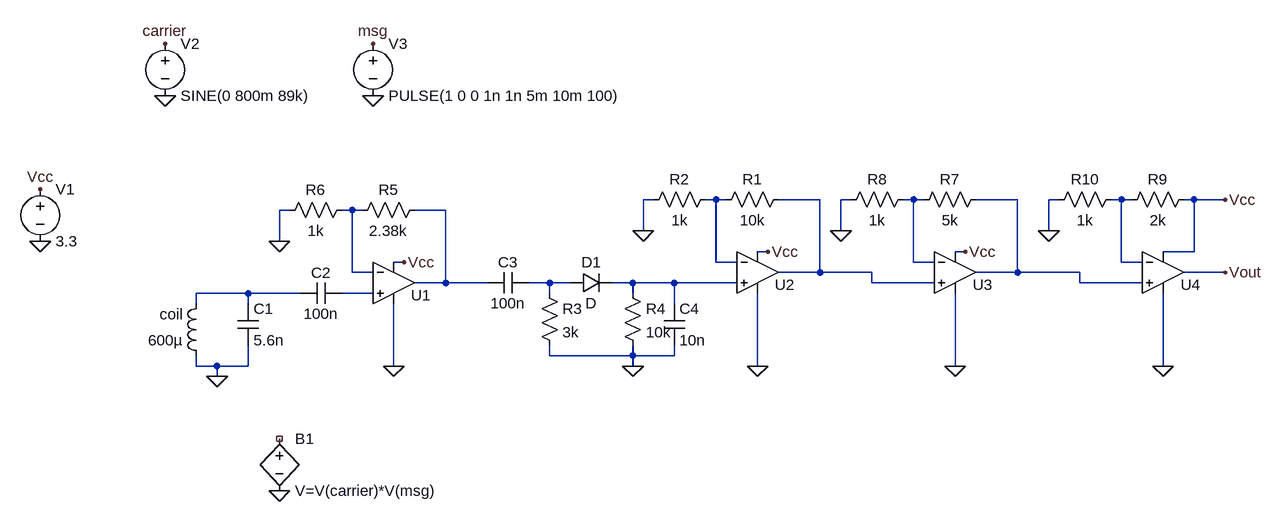
[diagram p0: schematic LTSpice.asc]
LTSpice.asc, the LTspice schematic file:
Version 4.1
SHEET 1 1768 680
WIRE 688 -16 672 -16
WIRE 784 -16 768 -16
WIRE 800 -16 784 -16
WIRE 944 -16 880 -16
WIRE 992 -16 976 -16
WIRE 1088 -16 1072 -16
WIRE 1104 -16 1088 -16
WIRE 1248 -16 1184 -16
WIRE 1312 -16 1296 -16
WIRE 1408 -16 1392 -16
WIRE 1424 -16 1408 -16
WIRE 1520 -16 1504 -16
WIRE 1568 -16 1520 -16
WIRE 128 0 112 0
WIRE 224 0 208 0
WIRE 240 0 224 0
WIRE 368 0 320 0
WIRE 672 32 672 -16
WIRE 976 32 976 -16
WIRE 1296 32 1296 -16
WIRE 112 48 112 0
WIRE 864 64 848 64
WIRE 1168 64 1152 64
WIRE 1520 64 1520 -16
WIRE 1520 64 1472 64
WIRE 304 80 288 80
WIRE 784 80 784 -16
WIRE 816 80 784 80
WIRE 1088 80 1088 -16
WIRE 1120 80 1088 80
WIRE 1408 80 1408 -16
WIRE 1440 80 1408 80
WIRE 224 96 224 0
WIRE 256 96 224 96
WIRE 944 96 944 -16
WIRE 944 96 880 96
WIRE 1024 96 944 96
WIRE 1248 96 1248 -16
WIRE 1248 96 1184 96
WIRE 1344 96 1248 96
WIRE 1568 96 1504 96
WIRE 368 112 368 0
WIRE 368 112 320 112
WIRE 432 112 368 112
WIRE 528 112 496 112
WIRE 560 112 528 112
WIRE 656 112 624 112
WIRE 720 112 656 112
WIRE 816 112 720 112
WIRE 1024 112 1024 96
WIRE 1120 112 1024 112
WIRE 1344 112 1344 96
WIRE 1440 112 1344 112
WIRE 64 128 -16 128
WIRE 144 128 64 128
WIRE 256 128 208 128
WIRE 528 128 528 112
WIRE 656 128 656 112
WIRE -16 144 -16 128
WIRE 64 144 64 128
WIRE 720 144 720 112
WIRE 528 224 528 208
WIRE 656 224 656 208
WIRE 656 224 528 224
WIRE 720 224 720 208
WIRE 720 224 656 224
WIRE -16 240 -16 224
WIRE 16 240 -16 240
WIRE 64 240 64 208
WIRE 64 240 16 240
WIRE 288 240 288 144
WIRE 656 240 656 224
WIRE 848 240 848 128
WIRE 1152 240 1152 128
WIRE 1472 240 1472 128
WIRE 16 256 16 240
FLAG 16 256 0
FLAG -256 48 0
FLAG -256 -32 Vcc
FLAG 288 240 0
FLAG 304 80 Vcc
FLAG 656 240 0
FLAG 848 240 0
FLAG 864 64 Vcc
FLAG 672 32 0
FLAG 112 48 0
FLAG 1152 240 0
FLAG 1168 64 Vcc
FLAG 976 32 0
FLAG 1472 240 0
FLAG 1296 32 0
FLAG 1568 -16 Vcc
FLAG 1568 96 Vout
FLAG -64 -256 carrier
FLAG 256 -256 msg
FLAG 256 -176 0
FLAG -64 -176 0
FLAG 112 432 0
SYMBOL ind 0 240 R180
WINDOW 0 36 80 Left 2
WINDOW 3 36 40 Left 2
SYMATTR InstName coil
SYMATTR Value 600µ
SYMBOL cap 48 144 R0
SYMATTR InstName C1
SYMATTR Value 5.6n
SYMBOL cap 208 112 R90
WINDOW 0 0 32 VBottom 2
WINDOW 3 32 32 VTop 2
SYMATTR InstName C2
SYMATTR Value 100n
SYMBOL OpAmps\\UniversalOpAmp 288 112 R0
WINDOW 0 27 19 Left 2
SYMATTR InstName U1
SYMBOL voltage -256 -48 R0
WINDOW 123 0 0 Left 0
WINDOW 39 0 0 Left 0
SYMATTR InstName V1
SYMATTR Value 3.3
SYMBOL cap 496 96 R90
WINDOW 0 0 32 VBottom 2
WINDOW 3 32 32 VTop 2
SYMATTR InstName C3
SYMATTR Value 100n
SYMBOL res 512 112 R0
SYMATTR InstName R3
SYMATTR Value 3k
SYMBOL diode 560 128 R270
WINDOW 0 32 32 VTop 2
WINDOW 3 0 32 VBottom 2
SYMATTR InstName D1
SYMBOL res 640 112 R0
SYMATTR InstName R4
SYMATTR Value 10k
SYMBOL cap 704 144 R0
SYMATTR InstName C4
SYMATTR Value 10n
SYMBOL OpAmps\\UniversalOpAmp 848 96 R0
WINDOW 0 27 19 Left 2
SYMATTR InstName U2
SYMBOL res 896 -32 R90
WINDOW 0 0 56 VBottom 2
WINDOW 3 32 56 VTop 2
SYMATTR InstName R1
SYMATTR Value 10k
SYMBOL res 784 -32 R90
WINDOW 0 0 56 VBottom 2
WINDOW 3 32 56 VTop 2
SYMATTR InstName R2
SYMATTR Value 1k
SYMBOL res 336 -16 R90
WINDOW 0 0 56 VBottom 2
WINDOW 3 32 56 VTop 2
SYMATTR InstName R5
SYMATTR Value 2.38k
SYMBOL res 224 -16 R90
WINDOW 0 0 56 VBottom 2
WINDOW 3 32 56 VTop 2
SYMATTR InstName R6
SYMATTR Value 1k
SYMBOL OpAmps\\UniversalOpAmp 1152 96 R0
WINDOW 0 27 19 Left 2
SYMATTR InstName U3
SYMBOL res 1200 -32 R90
WINDOW 0 0 56 VBottom 2
WINDOW 3 32 56 VTop 2
SYMATTR InstName R7
SYMATTR Value 5k
SYMBOL res 1088 -32 R90
WINDOW 0 0 56 VBottom 2
WINDOW 3 32 56 VTop 2
SYMATTR InstName R8
SYMATTR Value 1k
SYMBOL OpAmps\\UniversalOpAmp 1472 96 R0
WINDOW 0 27 19 Left 2
SYMATTR InstName U4
SYMBOL res 1520 -32 R90
WINDOW 0 0 56 VBottom 2
WINDOW 3 32 56 VTop 2
SYMATTR InstName R9
SYMATTR Value 2k
SYMBOL res 1408 -32 R90
WINDOW 0 0 56 VBottom 2
WINDOW 3 32 56 VTop 2
SYMATTR InstName R10
SYMATTR Value 1k
SYMBOL voltage -64 -272 R0
SYMATTR InstName V2
SYMATTR Value SINE(0 800m 89k)
SYMBOL voltage 256 -272 R0
SYMATTR InstName V3
SYMATTR Value PULSE(1 0 0 1n 1n 5m 10m 100)
SYMBOL bv 112 336 R0
SYMATTR InstName B1
SYMATTR Value V=V(carrier)*V(msg)

The netlist it stands for:
* LTSpice.asc
L§coil 0 N010 600µ
C1 N010 0 5.6n
C2 N011 N010 100n
X§U1 N011 N006 Vcc 0 N007 level1 Avol=1Meg GBW=10Meg Vos=0 En=0 Enk=0 In=0 Ink=0 Rin=500Meg  ; pins In+ In- V+ V- OUT
V1 Vcc 0 3.3
C3 N008 N007 100n
R3 N008 0 3k
D1 N008 N009 D
R4 N009 0 10k
C4 N009 0 10n
X§U2 N009 N001 Vcc 0 N002 level1 Avol=1Meg GBW=10Meg Vos=0 En=0 Enk=0 In=0 Ink=0 Rin=500Meg  ; pins In+ In- V+ V- OUT
R1 N002 N001 10k
R2 N001 0 1k
R5 N007 N006 2.38k
R6 N006 0 1k
X§U3 N002 N003 Vcc 0 N004 level1 Avol=1Meg GBW=10Meg Vos=0 En=0 Enk=0 In=0 Ink=0 Rin=500Meg  ; pins In+ In- V+ V- OUT
R7 N004 N003 5k
R8 N003 0 1k
X§U4 N004 N005 Vcc 0 Vout level1 Avol=1Meg GBW=10Meg Vos=0 En=0 Enk=0 In=0 Ink=0 Rin=500Meg  ; pins In+ In- V+ V- OUT
R9 Vcc N005 2k
R10 N005 0 1k
V2 carrier 0 SINE(0 800m 89k)
V3 msg 0 PULSE(1 0 0 1n 1n 5m 10m 100)
B1 NC_01 0 V=V(carrier)*V(msg)
.model D D
.lib standard.dio
.lib UniversalOpAmp1.lib
.backanno
.end